# Altium project CPCIs_EEM_Controller.PrjPCB (part 1 of 2)
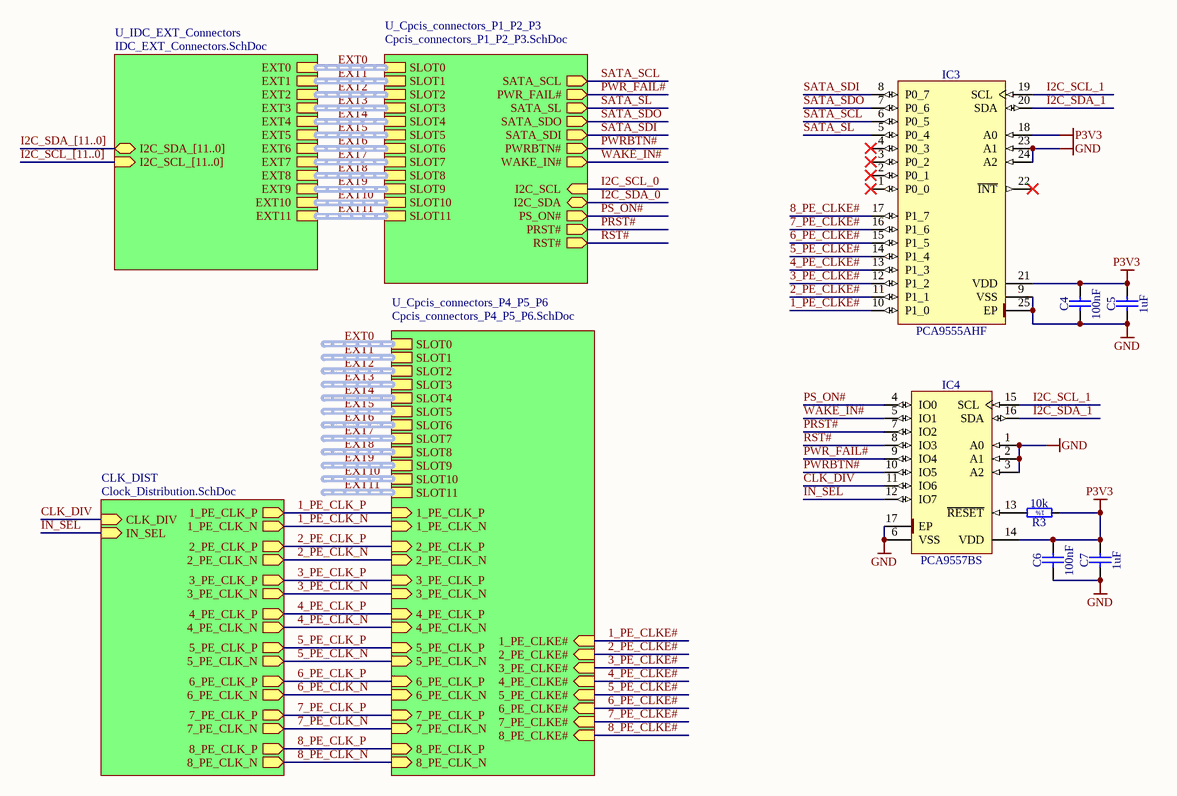
[diagram p0: CPCIS_EEM_Controller.SchDoc]
5 sheets, 84 parts. Net scope: hierarchical (ports join the sheet entries above them; power ports are global).
Board file: cPCIs_controller.pcbdoc
Sheets:
  CPCIS_EEM_Controller.SchDoc
    U_Cpcis_connectors_P1_P2_P3 = Cpcis_connectors_P1_P2_P3.SchDoc
    U_Cpcis_connectors_P4_P5_P6 = Cpcis_connectors_P4_P5_P6.SchDoc
    U_IDC_EXT_Connectors = IDC_EXT_Connectors.SchDoc
    CLK_DIST = Clock_Distribution.SchDoc

## Sheet CPCIS_EEM_Controller.SchDoc
size A4

### Parts
C4  100nF  [CAPC0603X33N]
C5  1uF  [CAPC1608X87N]
C6  100nF  [CAPC0603X33N]
C7  1uF  [CAPC1608X87N]
IC3  PCA9555AHF  [QFN50P400X400X80-25N-S225]
IC4  PCA9557BS  [QFN65P400X400X100-17N-S225]
R3  10k  [RESC1005X40N]

### Sub-sheets
CLK_DIST = Clock_Distribution.SchDoc: 1_PE_CLK_P (out), 1_PE_CLK_N (out), 2_PE_CLK_P (out), 2_PE_CLK_N (out), 3_PE_CLK_P (out), 3_PE_CLK_N (out), 4_PE_CLK_P (out), 4_PE_CLK_N (out), 5_PE_CLK_P (out), 5_PE_CLK_N (out), 6_PE_CLK_P (out), 6_PE_CLK_N (out), 7_PE_CLK_P (out), 7_PE_CLK_N (out), 8_PE_CLK_P (out), 8_PE_CLK_N (out), CLK_DIV (in), IN_SEL (in)
U_Cpcis_connectors_P1_P2_P3 = Cpcis_connectors_P1_P2_P3.SchDoc: SLOT2 (harness ExtensionConnector), SLOT3 (harness ExtensionConnector), SLOT1 (harness ExtensionConnector), SLOT4 (harness ExtensionConnector), SLOT5 (harness ExtensionConnector), SLOT6 (harness ExtensionConnector), SLOT7 (harness ExtensionConnector), SLOT8 (harness ExtensionConnector), SATA_SCL (out), PWR_FAIL# (out), SATA_SL (out), SATA_SDO (out), SATA_SDI (out), PWRBTN# (out), WAKE_IN# (out), I2C_SCL (in), I2C_SDA (bidir), PS_ON# (out), PRST# (out), RST# (out), SLOT9 (harness ExtensionConnector), SLOT10 (harness ExtensionConnector), SLOT11 (harness ExtensionConnector), SLOT0 (harness ExtensionConnector)
U_Cpcis_connectors_P4_P5_P6 = Cpcis_connectors_P4_P5_P6.SchDoc: SLOT2 (harness ExtensionConnector), SLOT3 (harness ExtensionConnector), SLOT1 (harness ExtensionConnector), SLOT4 (harness ExtensionConnector), SLOT5 (harness ExtensionConnector), SLOT6 (harness ExtensionConnector), SLOT7 (harness ExtensionConnector), SLOT8 (harness ExtensionConnector), 1_PE_CLK_P (in), 1_PE_CLK_N (in), 2_PE_CLK_P (in), 2_PE_CLK_N (in), 3_PE_CLK_P (in), 3_PE_CLK_N (in), 4_PE_CLK_P (in), 4_PE_CLK_N (in), 5_PE_CLK_P (in), 5_PE_CLK_N (in), 6_PE_CLK_P (in), 6_PE_CLK_N (in), 7_PE_CLK_P (in), 7_PE_CLK_N (in), 8_PE_CLK_P (in), 8_PE_CLK_N (in), 3_PE_CLKE# (in), 6_PE_CLKE# (in), 1_PE_CLKE# (in), 5_PE_CLKE# (in), 7_PE_CLKE# (in), 4_PE_CLKE# (in), 8_PE_CLKE# (in), 2_PE_CLKE# (in), SLOT9 (harness ExtensionConnector), SLOT10 (harness ExtensionConnector), SLOT11 (harness ExtensionConnector), SLOT0 (harness ExtensionConnector)
U_IDC_EXT_Connectors = IDC_EXT_Connectors.SchDoc: EXT0 (harness ExtensionConnector), EXT2 (harness ExtensionConnector), EXT4 (harness ExtensionConnector), EXT5 (harness ExtensionConnector), EXT6 (harness ExtensionConnector), EXT7 (harness ExtensionConnector), I2C_SDA_[11..0] (bidir), I2C_SCL_[11..0] (in), EXT3 (harness ExtensionConnector), EXT1 (harness ExtensionConnector), EXT8 (harness ExtensionConnector), EXT9 (harness ExtensionConnector), EXT10 (harness ExtensionConnector), EXT11 (harness ExtensionConnector)

### Nets
GND: C4.1 C5.1 C6.1 C7.1 IC3.9(VSS) IC3.23(A1) IC3.24(A2) IC3.25(EP) IC4.1(A0) IC4.2(A1) IC4.3(A2) IC4.6(VSS) IC4.17(EP)
P3V3: C4.2 C5.2 C6.2 C7.2 IC3.18(A0) IC3.21(VDD) IC4.14(VDD) R3.1
1_PE_CLK_N: sheet U_Cpcis_connectors_P4_P5_P6/1_PE_CLK_N, sheet CLK_DIST/1_PE_CLK_N
1_PE_CLK_P: sheet U_Cpcis_connectors_P4_P5_P6/1_PE_CLK_P, sheet CLK_DIST/1_PE_CLK_P
1_PE_CLKE#: IC3.10(P1_0) ; sheet U_Cpcis_connectors_P4_P5_P6/1_PE_CLKE#
2_PE_CLK_N: sheet U_Cpcis_connectors_P4_P5_P6/2_PE_CLK_N, sheet CLK_DIST/2_PE_CLK_N
2_PE_CLK_P: sheet U_Cpcis_connectors_P4_P5_P6/2_PE_CLK_P, sheet CLK_DIST/2_PE_CLK_P
2_PE_CLKE#: IC3.11(P1_1) ; sheet U_Cpcis_connectors_P4_P5_P6/2_PE_CLKE#
3_PE_CLK_N: sheet U_Cpcis_connectors_P4_P5_P6/3_PE_CLK_N, sheet CLK_DIST/3_PE_CLK_N
3_PE_CLK_P: sheet U_Cpcis_connectors_P4_P5_P6/3_PE_CLK_P, sheet CLK_DIST/3_PE_CLK_P
3_PE_CLKE#: IC3.12(P1_2) ; sheet U_Cpcis_connectors_P4_P5_P6/3_PE_CLKE#
4_PE_CLK_N: sheet U_Cpcis_connectors_P4_P5_P6/4_PE_CLK_N, sheet CLK_DIST/4_PE_CLK_N
4_PE_CLK_P: sheet U_Cpcis_connectors_P4_P5_P6/4_PE_CLK_P, sheet CLK_DIST/4_PE_CLK_P
4_PE_CLKE#: IC3.13(P1_3) ; sheet U_Cpcis_connectors_P4_P5_P6/4_PE_CLKE#
5_PE_CLK_N: sheet U_Cpcis_connectors_P4_P5_P6/5_PE_CLK_N, sheet CLK_DIST/5_PE_CLK_N
5_PE_CLK_P: sheet U_Cpcis_connectors_P4_P5_P6/5_PE_CLK_P, sheet CLK_DIST/5_PE_CLK_P
5_PE_CLKE#: IC3.14(P1_4) ; sheet U_Cpcis_connectors_P4_P5_P6/5_PE_CLKE#
6_PE_CLK_N: sheet U_Cpcis_connectors_P4_P5_P6/6_PE_CLK_N, sheet CLK_DIST/6_PE_CLK_N
6_PE_CLK_P: sheet U_Cpcis_connectors_P4_P5_P6/6_PE_CLK_P, sheet CLK_DIST/6_PE_CLK_P
6_PE_CLKE#: IC3.15(P1_5) ; sheet U_Cpcis_connectors_P4_P5_P6/6_PE_CLKE#
7_PE_CLK_N: sheet U_Cpcis_connectors_P4_P5_P6/7_PE_CLK_N, sheet CLK_DIST/7_PE_CLK_N
7_PE_CLK_P: sheet U_Cpcis_connectors_P4_P5_P6/7_PE_CLK_P, sheet CLK_DIST/7_PE_CLK_P
7_PE_CLKE#: IC3.16(P1_6) ; sheet U_Cpcis_connectors_P4_P5_P6/7_PE_CLKE#
8_PE_CLK_N: sheet U_Cpcis_connectors_P4_P5_P6/8_PE_CLK_N, sheet CLK_DIST/8_PE_CLK_N
8_PE_CLK_P: sheet U_Cpcis_connectors_P4_P5_P6/8_PE_CLK_P, sheet CLK_DIST/8_PE_CLK_P
8_PE_CLKE#: IC3.17(P1_7) ; sheet U_Cpcis_connectors_P4_P5_P6/8_PE_CLKE#
CLK_DIV: IC4.11(IO6) ; sheet CLK_DIST/CLK_DIV
I2C_SCL_1: IC3.19(SCL) IC4.15(SCL)
I2C_SDA_1: IC3.20(SDA) IC4.16(SDA)
IN_SEL: IC4.12(IO7) ; sheet CLK_DIST/IN_SEL
PRST#: IC4.7(IO2) ; sheet U_Cpcis_connectors_P1_P2_P3/PRST#
PS_ON#: IC4.4(IO0) ; sheet U_Cpcis_connectors_P1_P2_P3/PS_ON#
PWR_FAIL#: IC4.9(IO4) ; sheet U_Cpcis_connectors_P1_P2_P3/PWR_FAIL#
PWRBTN#: IC4.10(IO5) ; sheet U_Cpcis_connectors_P1_P2_P3/PWRBTN#
RST#: IC4.8(IO3) ; sheet U_Cpcis_connectors_P1_P2_P3/RST#
SATA_SCL: IC3.6(P0_5) ; sheet U_Cpcis_connectors_P1_P2_P3/SATA_SCL
SATA_SDI: IC3.8(P0_7) ; sheet U_Cpcis_connectors_P1_P2_P3/SATA_SDI
SATA_SDO: IC3.7(P0_6) ; sheet U_Cpcis_connectors_P1_P2_P3/SATA_SDO
SATA_SL: IC3.5(P0_4) ; sheet U_Cpcis_connectors_P1_P2_P3/SATA_SL
WAKE_IN#: IC4.5(IO1) ; sheet U_Cpcis_connectors_P1_P2_P3/WAKE_IN#
NetIC4_13: IC4.13(~{RESET}) R3.2

Not connected (* = marked no-connect by the designer): IC3 1(P0_0)* 2(P0_1)* 3(P0_2)* 4(P0_3)* 22(~{INT})*

### Buses and harness runs
bus I2C_SCL_[11..0] = sheet U_IDC_EXT_Connectors/I2C_SCL_[11..0]
bus I2C_SDA_[11..0] = sheet U_IDC_EXT_Connectors/I2C_SDA_[11..0]
harness EXT0 = sheet U_Cpcis_connectors_P1_P2_P3/SLOT0 = sheet U_IDC_EXT_Connectors/EXT0
harness EXT0 = sheet U_Cpcis_connectors_P4_P5_P6/SLOT0
harness EXT1 = sheet U_Cpcis_connectors_P1_P2_P3/SLOT1 = sheet U_IDC_EXT_Connectors/EXT1
harness EXT1 = sheet U_Cpcis_connectors_P4_P5_P6/SLOT1
harness EXT2 = sheet U_Cpcis_connectors_P1_P2_P3/SLOT2 = sheet U_IDC_EXT_Connectors/EXT2
harness EXT2 = sheet U_Cpcis_connectors_P4_P5_P6/SLOT2
harness EXT3 = sheet U_Cpcis_connectors_P1_P2_P3/SLOT3 = sheet U_IDC_EXT_Connectors/EXT3
harness EXT3 = sheet U_Cpcis_connectors_P4_P5_P6/SLOT3
harness EXT4 = sheet U_Cpcis_connectors_P1_P2_P3/SLOT4 = sheet U_IDC_EXT_Connectors/EXT4
harness EXT4 = sheet U_Cpcis_connectors_P4_P5_P6/SLOT4
harness EXT5 = sheet U_Cpcis_connectors_P1_P2_P3/SLOT5 = sheet U_IDC_EXT_Connectors/EXT5
harness EXT5 = sheet U_Cpcis_connectors_P4_P5_P6/SLOT5
harness EXT6 = sheet U_Cpcis_connectors_P1_P2_P3/SLOT6 = sheet U_IDC_EXT_Connectors/EXT6
harness EXT6 = sheet U_Cpcis_connectors_P4_P5_P6/SLOT6
harness EXT7 = sheet U_Cpcis_connectors_P1_P2_P3/SLOT7 = sheet U_IDC_EXT_Connectors/EXT7
harness EXT7 = sheet U_Cpcis_connectors_P4_P5_P6/SLOT7
harness EXT8 = sheet U_Cpcis_connectors_P1_P2_P3/SLOT8 = sheet U_IDC_EXT_Connectors/EXT8
harness EXT8 = sheet U_Cpcis_connectors_P4_P5_P6/SLOT8
harness EXT9 = sheet U_Cpcis_connectors_P1_P2_P3/SLOT9 = sheet U_IDC_EXT_Connectors/EXT9
harness EXT9 = sheet U_Cpcis_connectors_P4_P5_P6/SLOT9
harness EXT10 = sheet U_Cpcis_connectors_P1_P2_P3/SLOT10 = sheet U_IDC_EXT_Connectors/EXT10
harness EXT10 = sheet U_Cpcis_connectors_P4_P5_P6/SLOT10
harness EXT11 = sheet U_Cpcis_connectors_P1_P2_P3/SLOT11 = sheet U_IDC_EXT_Connectors/EXT11
harness EXT11 = sheet U_Cpcis_connectors_P4_P5_P6/SLOT11

### Notes on the sheet
- (in symbol R0402_10K_1%_0.0625W_100PPM) 1%

### Library data of the parts
C4 C6 = CC0201_100NF_6.3V_10%_X5R: Non-polarised capacitor; Part Description: SMD Multilayer Chip Ceramic Capacitor; Manufacturer: GENERIC; Manufacturer1 Part Number: 02016D104KAT2A; Voltage: 6.3V; TC: X5R; Tolerance: ±10%; Part Number: CC0201_100NF_6.3V_10%_X5R; Component Kind: Standard; Component Type: Standard; Pin Count: 2; Value: 100nF; Status: Not Recommended; Manufacturer Part Number: CC0201_100NF_6.3V_10%_X5R; Case: 0201; Mounted: Yes; Socket: No; SMD: Yes; Sense: No; Manufacturer1 Example: AVX; Manufacturer1 ComponentHeight: 0.33mm; HelpURL: \\cern.ch\dfs\Applications\Altium\Datasheets\CC0201_X5R_AVX.pdf; Author: CERN DEM JLC; CreateDate: 03.12.2007; LatestRevisionDate: 03.12.2007
C5 C7 = CC0603_1UF_25V_10%_X7R: Non-polarised capacitor; Part Description: SMD Multilayer Chip Ceramic Capacitor; Manufacturer: GENERIC; Manufacturer1 Part Number: GRM188R71E105KA12D; Voltage: 25V; TC: X7R; Tolerance: ±10%; Part Number: CC0603_1UF_25V_10%_X7R; Component Kind: Standard; Component Type: Standard; Pin Count: 2; Value: 1uF; Status: None; Manufacturer Part Number: CC0603_1UF_25V_10%_X7R; Case: 0603; Mounted: Yes; Socket: No; SMD: Yes; Sense: No; Manufacturer1 Example: MURATA; Manufacturer1 ComponentHeight: 0.9mm; HelpURL: \\cern.ch\dfs\Applications\Altium\Datasheets\CC0603_X7R_MURATA.pdf; Author: CERN DEM JLC; CreateDate: 18.01.2011; LatestRevisionDate: 18.01.2011
IC3 = PCA9555AHF: Low-Voltage 16-Bit I2C-bus I/O Port With Interrupt and Weak Pull-Up; Manufacturer: NXP SEMICONDUCTORS; PressFit: No; Bonding: No; Part Number: PCA9555AHF; Component Kind: Standard; Component Type: Standard; Device: PCA9555AHF; PackageDescription: QFN, 0.50mm Pitch, Square; 24 Pin, 4.00mm L X 4.00mm W X 0.80mm H body (w/Thermal Tab 2.25 X 2.25mm), IPC Medium Density; Part Description: Low-Voltage 16-Bit I2C-bus I/O Port With Interrupt and Weak Pull-Up; Manufacturer Part Number: PCA9555AHF; Pin Count: 25; Case: QFN24; Mounted: Yes; Socket: No; SMD: Yes; Sense: No; ComponentHeight: 0.8mm; Author: CERN DEM BC; HelpURL: \\cern.ch\dfs\Applications\Altium\Datasheets\PCA9555AHF.pdf; CreateDate: 24.07.2015; LatestRevisionDate: 24.07.2015
IC4 = PCA9557BS: 8-Bit I2C-bus and SMBus I/O Port with Reset; Manufacturer: NXP SEMICONDUCTORS; PressFit: No; Bonding: No; Part Number: PCA9557BS; Component Kind: Standard; Component Type: Standard; Device: PCA9557BS; PackageDescription: QFN, 0.65mm Pitch, Square; 16 Pin, 4.00mm L X 4.00mm W X 1.00mm H body (w/Thermal Tab 2.25 X 2.25mm), IPC Medium Density; Part Description: 8-Bit I2C-bus and SMBus I/O Port with Reset; Manufacturer Part Number: PCA9557BS; Pin Count: 17; Case: QFN16; Mounted: Yes; Socket: No; SMD: Yes; Sense: No; ComponentHeight: 1mm; Author: CERN DEM JMW; HelpURL: \\cern.ch\dfs\Applications\Altium\Datasheets\PCA9557BS.pdf; CreateDate: 22.09.2015; LatestRevisionDate: 22.09.2015
R3 = R0402_10K_1%_0.0625W_100PPM: Resistor - 1%; Part Description: General Purpose Thick Film Chip Resistor; Manufacturer: GENERIC; Manufacturer1 Part Number: 232270671003L; TC: ±100ppm/°C; Part Number: R0402_10K_1%_0.0625W_100PPM; Component Kind: Standard; Component Type: Standard; Pin Count: 2; Value: 10k; Status: Not recommended; Power: 0.0625W; Tolerance: ±1%; Manufacturer Part Number: R0402_10K_1%_0.0625W_100PPM; Case: 0402; Mounted: Yes; Sense: No; Socket: No; SMD: Yes; Manufacturer1 Example: YAGEO PHYCOMP; Manufacturer1 ComponentHeight: 0.4mm; HelpURL: \\cern.ch\dfs\Applications\Altium\Datasheets\R0402_Phycomp_RC0402.pdf; Author: CERN DEM JLC; CreateDate: 03.12.2007; LatestRevisionDate: 17.10.2012

## Sheet Cpcis_connectors_P1_P2_P3.SchDoc: CPCIS Backplane
size 420 x 297 mm; CheckedBy: A.Paixao; CompanyName: CERN; DrawnBy: G. Daniluk; Engineer: G. Daniluk; Organization: CERN; Address1: European Organization for Nuclear Research; Address2: CH-1211 Genève 23 - Switzerland; DocumentNumber: 18; SheetNumber: 18; SheetTotal: 19; Title2: P1 to P4; DivGrp: BE/CO; Designer: G. Daniluk; EDA_Number: EDA-03828-V1-0; Projet: DIOT Demonstrator System Board (based on C-GEFE v1); ModifiedBy: G. Daniluk; CheckedDate: 18/06/2018; ProjectName: Distributed I/O Tier
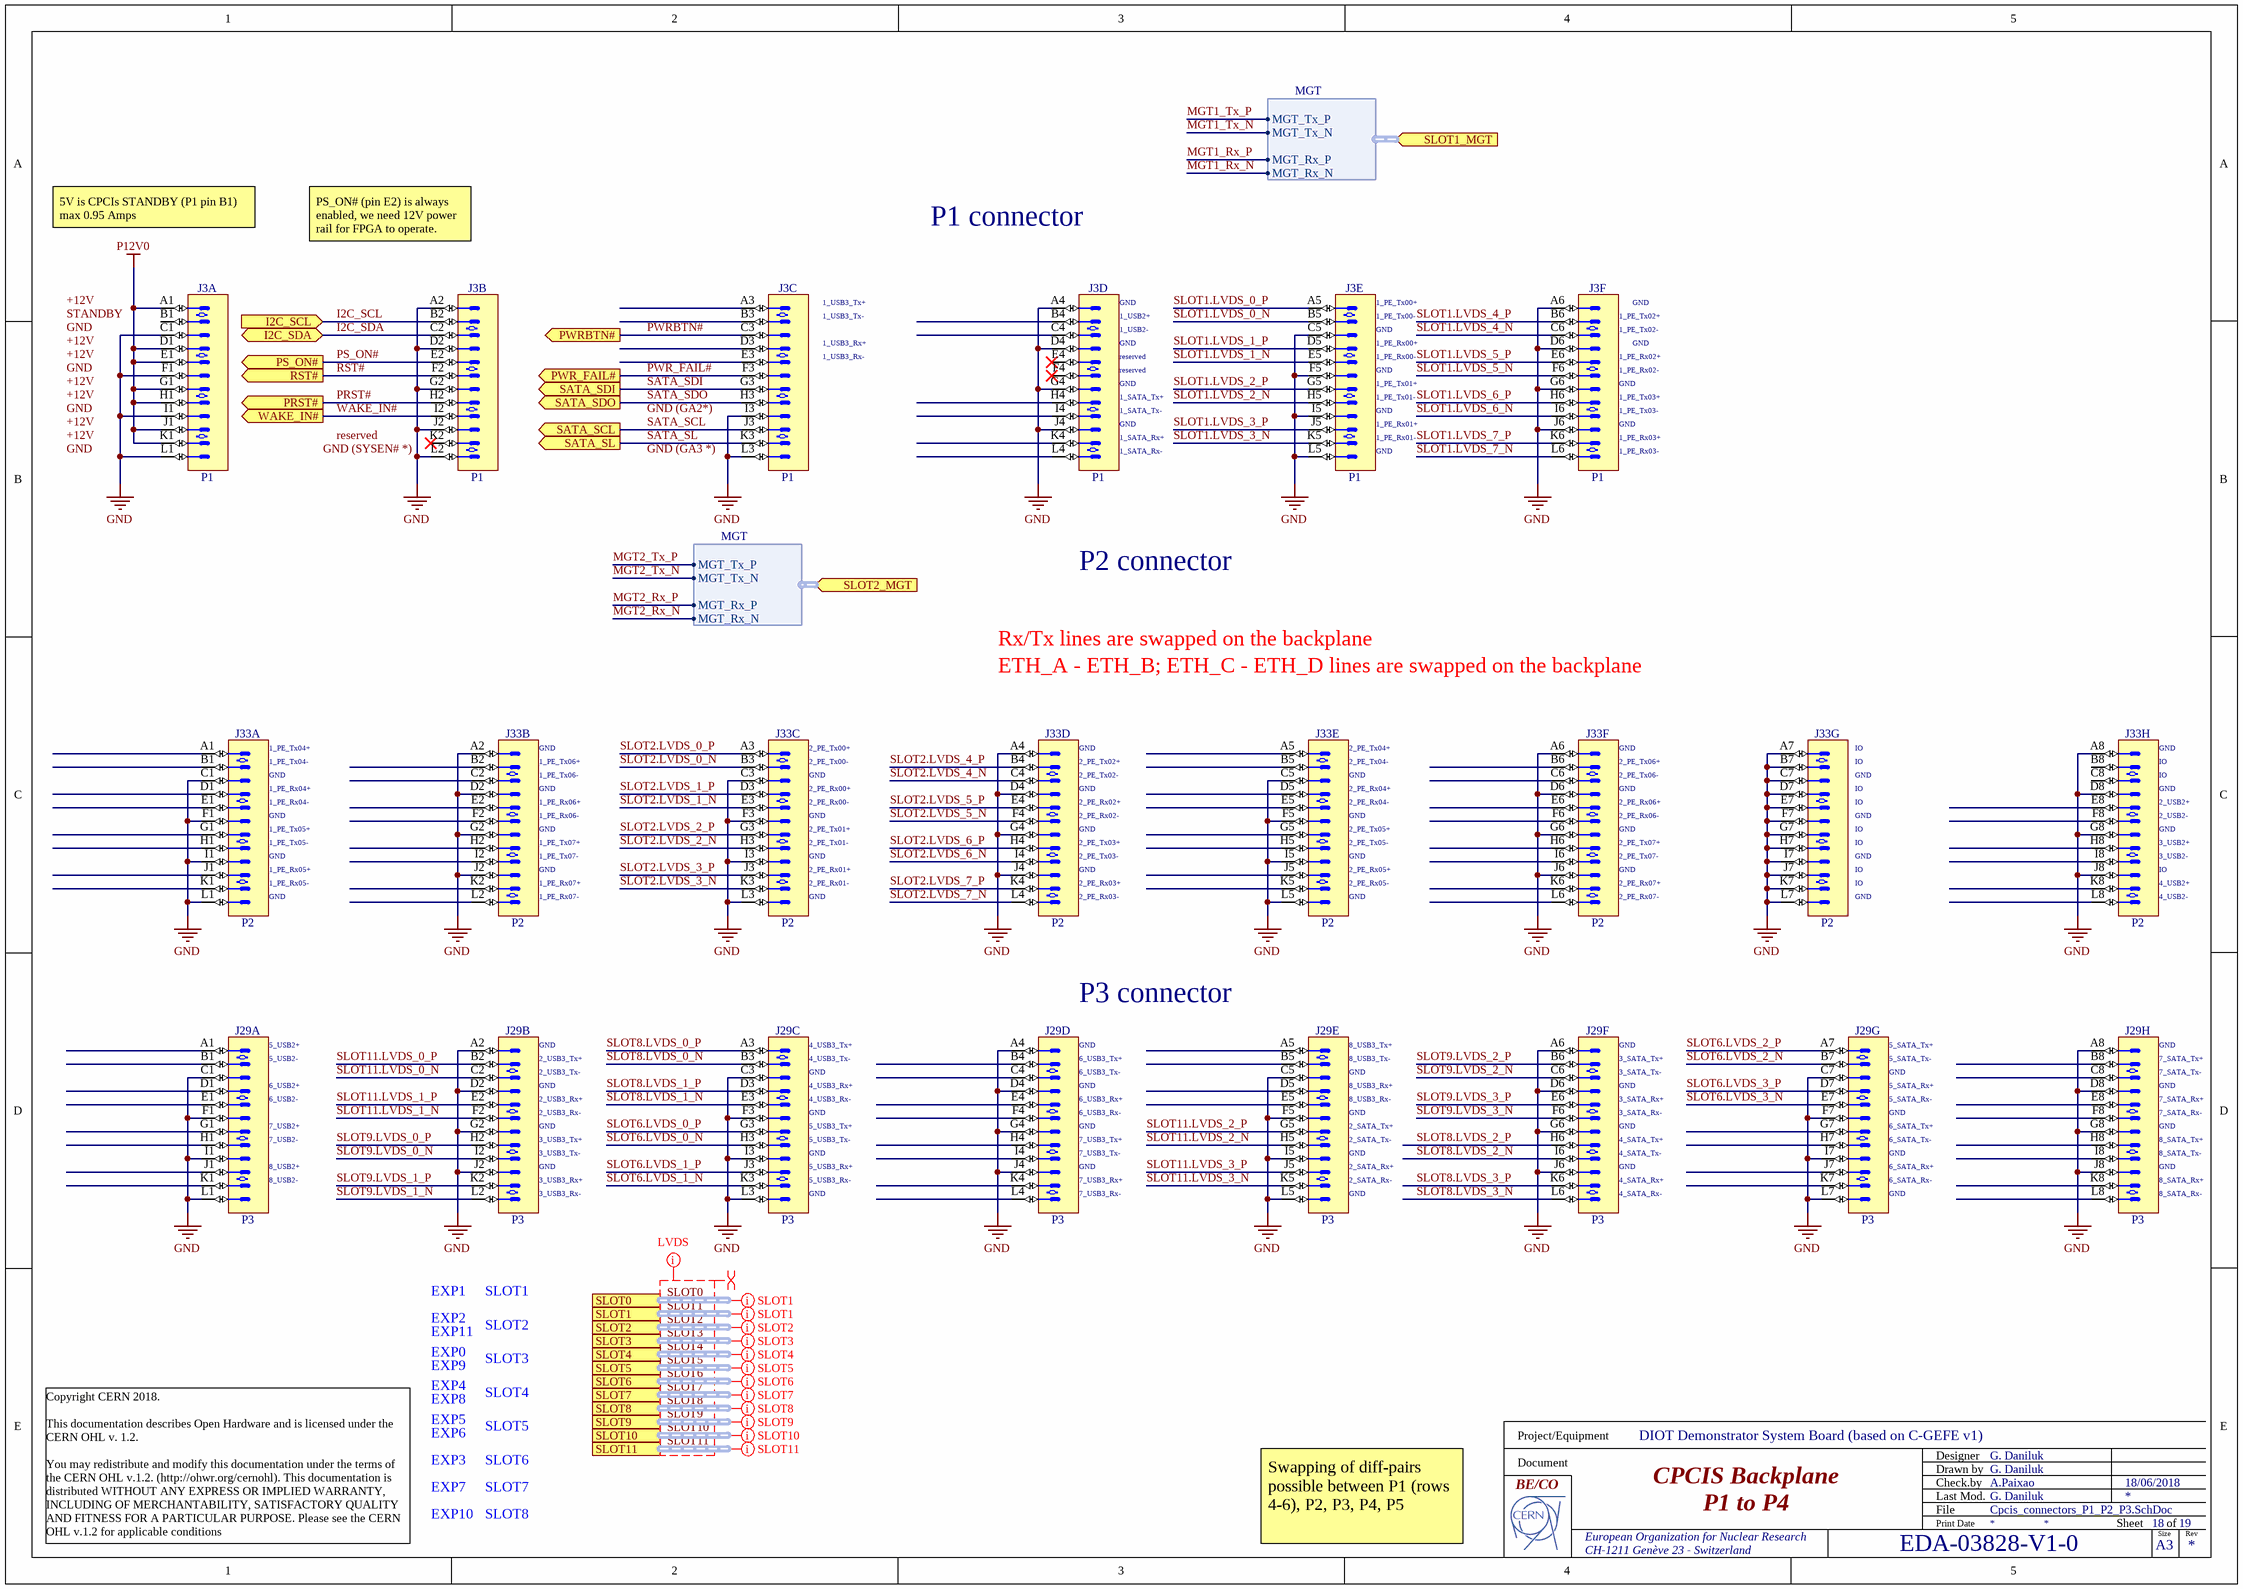
[diagram p1: Cpcis_connectors_P1_P2_P3.SchDoc]

### Parts
J3  P1  [AMPHENOL_10052825-101LF]  (parts A,B,C,D,E,F of 6)
J29  P3  [AMPHENOL_10052837-101LF]  (parts A,B,C,D,E,F,G,H of 8)
J33  P2  [AMPHENOL_10052837-101LF]  (parts A,B,C,D,E,F,G,H of 8)

### Ports
I2C_SCL (in), I2C_SDA (bidir), PRST# (out), PS_ON# (out), PWR_FAIL# (out), PWRBTN# (out), RST# (out), SATA_SCL (out), SATA_SDI (out), SATA_SDO (out), SATA_SL (out), SLOT0 (harness ExtensionConnector), SLOT1 (harness ExtensionConnector), SLOT1_MGT (in, harness MGT), SLOT2 (harness ExtensionConnector), SLOT2_MGT (in, harness MGT), SLOT3 (harness ExtensionConnector), SLOT4 (harness ExtensionConnector), SLOT5 (harness ExtensionConnector), SLOT6 (harness ExtensionConnector), SLOT7 (harness ExtensionConnector), SLOT8 (harness ExtensionConnector), SLOT9 (harness ExtensionConnector), SLOT10 (harness ExtensionConnector), SLOT11 (harness ExtensionConnector), WAKE_IN# (out)

### Harnesses
MGT: MGT_Tx_P, MGT_Tx_N, MGT_Rx_P, MGT_Rx_N

### Nets
GND: J3.A2 J3.A4 J3.A6 J3.C1 J3.C5 J3.D2 J3.D4 J3.D6 J3.F1 J3.F5 J3.G2 J3.G4 J3.G6 J3.I1 J3.I3 J3.I5 J3.J2 J3.J4 J3.J6 J3.L1 J3.L2 J3.L3 J3.L5 J29.A2 J29.A4 J29.A6 J29.A8 J29.C1 J29.C3 J29.C5 J29.C7 J29.D2 J29.D4 J29.D6 J29.D8 J29.F1 J29.F3 J29.F5 J29.F7 J29.G2 J29.G4 J29.G6 J29.G8 J29.I1 J29.I3 J29.I5 J29.I7 J29.J2 J29.J4 J29.J6 J29.J8 J29.L1 J29.L3 J29.L5 J29.L7 J33.A2 J33.A4 J33.A6 J33.A7 J33.A8 J33.B7 J33.C1 J33.C3 J33.C5 J33.C7 J33.D2 J33.D4 J33.D6 J33.D7 J33.D8 J33.E7 J33.F1 J33.F3 J33.F5 J33.F7 J33.G2 J33.G4 J33.G6 J33.G7 J33.G8 J33.H7 J33.I1 J33.I3 J33.I5 J33.I7 J33.J2 J33.J4 J33.J6 J33.J7 J33.J8 J33.K7 J33.L1 J33.L3 J33.L5 J33.L7
P12V0: J3.A1 J3.D1 J3.E1 J3.G1 J3.H1 J3.J1 J3.K1
I2C_SCL: J3.B2 ; port I2C_SCL
I2C_SDA: J3.C2 ; port I2C_SDA
MGT1_Rx_N: port SLOT1_MGT.MGT_Rx_N
MGT1_Rx_P: port SLOT1_MGT.MGT_Rx_P
MGT1_Tx_N: port SLOT1_MGT.MGT_Tx_N
MGT1_Tx_P: port SLOT1_MGT.MGT_Tx_P
MGT2_Rx_N: port SLOT2_MGT.MGT_Rx_N
MGT2_Rx_P: port SLOT2_MGT.MGT_Rx_P
MGT2_Tx_N: port SLOT2_MGT.MGT_Tx_N
MGT2_Tx_P: port SLOT2_MGT.MGT_Tx_P
PRST#: J3.H2 ; port PRST#
PS_ON#: J3.E2 ; port PS_ON#
PWR_FAIL#: J3.F3 ; port PWR_FAIL#
PWRBTN#: J3.C3 ; port PWRBTN#
RST#: J3.F2 ; port RST#
SATA_SCL: J3.J3 ; port SATA_SCL
SATA_SDI: J3.G3 ; port SATA_SDI
SATA_SDO: J3.H3 ; port SATA_SDO
SATA_SL: J3.K3 ; port SATA_SL
SLOT1.LVDS_0_N: J3.B5
SLOT1.LVDS_0_P: J3.A5
SLOT1.LVDS_1_N: J3.E5
SLOT1.LVDS_1_P: J3.D5
SLOT1.LVDS_2_N: J3.H5
SLOT1.LVDS_2_P: J3.G5
SLOT1.LVDS_3_N: J3.K5
SLOT1.LVDS_3_P: J3.J5
SLOT1.LVDS_4_N: J3.C6
SLOT1.LVDS_4_P: J3.B6
SLOT1.LVDS_5_N: J3.F6
SLOT1.LVDS_5_P: J3.E6
SLOT1.LVDS_6_N: J3.I6
SLOT1.LVDS_6_P: J3.H6
SLOT1.LVDS_7_N: J3.L6
SLOT1.LVDS_7_P: J3.K6
SLOT2.LVDS_0_N: J33.B3
SLOT2.LVDS_0_P: J33.A3
SLOT2.LVDS_1_N: J33.E3
SLOT2.LVDS_1_P: J33.D3
SLOT2.LVDS_2_N: J33.H3
SLOT2.LVDS_2_P: J33.G3
SLOT2.LVDS_3_N: J33.K3
SLOT2.LVDS_3_P: J33.J3
SLOT2.LVDS_4_N: J33.C4
SLOT2.LVDS_4_P: J33.B4
SLOT2.LVDS_5_N: J33.F4
SLOT2.LVDS_5_P: J33.E4
SLOT2.LVDS_6_N: J33.I4
SLOT2.LVDS_6_P: J33.H4
SLOT2.LVDS_7_N: J33.L4
SLOT2.LVDS_7_P: J33.K4
SLOT6.LVDS_0_N: J29.H3
SLOT6.LVDS_0_P: J29.G3
SLOT6.LVDS_1_N: J29.K3
SLOT6.LVDS_1_P: J29.J3
SLOT6.LVDS_2_N: J29.B7
SLOT6.LVDS_2_P: J29.A7
SLOT6.LVDS_3_N: J29.E7
SLOT6.LVDS_3_P: J29.D7
SLOT8.LVDS_0_N: J29.B3
SLOT8.LVDS_0_P: J29.A3
SLOT8.LVDS_1_N: J29.E3
SLOT8.LVDS_1_P: J29.D3
SLOT8.LVDS_2_N: J29.I6
SLOT8.LVDS_2_P: J29.H6
SLOT8.LVDS_3_N: J29.L6
SLOT8.LVDS_3_P: J29.K6
SLOT9.LVDS_0_N: J29.I2
SLOT9.LVDS_0_P: J29.H2
SLOT9.LVDS_1_N: J29.L2
SLOT9.LVDS_1_P: J29.K2
SLOT9.LVDS_2_N: J29.C6
SLOT9.LVDS_2_P: J29.B6
SLOT9.LVDS_3_N: J29.F6
SLOT9.LVDS_3_P: J29.E6
SLOT11.LVDS_0_N: J29.C2
SLOT11.LVDS_0_P: J29.B2
SLOT11.LVDS_1_N: J29.F2
SLOT11.LVDS_1_P: J29.E2
SLOT11.LVDS_2_N: J29.H5
SLOT11.LVDS_2_P: J29.G5
SLOT11.LVDS_3_N: J29.K5
SLOT11.LVDS_3_P: J29.J5
WAKE_IN#: J3.I2 ; port WAKE_IN#

Not connected (* = marked no-connect by the designer): J3 A3 B1 B3 B4 C4 D3 E3 E4* F4* H4 I4 K2* K4 L4; J29 A1 A5 B1 B4 B5 B8 C4 C8 D1 D5 E1 E4 E5 E8 F4 F8 G1 G7 H1 H4 H7 H8 I4 I8 J1 J7 K1 K4 K7 K8 L4 L8; J33 A1 A5 B1 B2 B5 B6 B8 C2 C6 C8 D1 D5 E1 E2 E5 E6 E8 F2 F6 F8 G1 G5 H1 H2 H5 H6 H8 I2 I6 I8 J1 J5 K1 K2 K5 K6 K8 L2 L6 L8

### Buses and harness runs
harness SLOT0 = port SLOT0
harness SLOT1 = port SLOT1
harness SLOT2 = port SLOT2
harness SLOT3 = port SLOT3
harness SLOT4 = port SLOT4
harness SLOT5 = port SLOT5
harness SLOT6 = port SLOT6
harness SLOT7 = port SLOT7
harness SLOT8 = port SLOT8
harness SLOT9 = port SLOT9
harness SLOT10 = port SLOT10
harness SLOT11 = port SLOT11

### Layout directives
net class LVDS: SLOT0, SLOT1, SLOT2, SLOT3, SLOT4, SLOT5, SLOT6, SLOT7, SLOT8, SLOT9, SLOT10, SLOT11
net class SLOT1: (no net found under the mark)
net class SLOT2: (no net found under the mark)
net class SLOT3: (no net found under the mark)
net class SLOT4: (no net found under the mark)
net class SLOT5: (no net found under the mark)
net class SLOT6: (no net found under the mark)
net class SLOT7: (no net found under the mark)
net class SLOT8: (no net found under the mark)
differential pair: SLOT0, SLOT1, SLOT2, SLOT3, SLOT4, SLOT5, SLOT6, SLOT7, SLOT8, SLOT9, SLOT10, SLOT11
net class SLOT9: (no net found under the mark)
net class SLOT10: (no net found under the mark)
net class SLOT11: (no net found under the mark)
net class SLOT0: (no net found under the mark)

### Notes on the sheet
- 5V is CPCIs STANDBY (P1 pin B1)
  max 0.95 Amps
- PS_ON# (pin E2) is always enabled, we need 12V power rail for FPGA to operate.
- P1 connector
- 1_USB3_Tx+
- 1_USB3_Tx-
- (near J3) 1_USB2+
- (near J3) GND
- (near J3) 1_PE_Tx00+
- (near J3) 1_PE_Tx00-
- (near J3) 1_PE_Tx02+
- GND
- 1_USB3_Rx+
- 1_USB3_Rx-
- (near J3) 1_USB2-
- (near J3) 1_SATA_Tx+
- (near J3) reserved
- (near J3) 1_PE_Tx01+
- (near J3) 1_PE_Tx01-
- (near J3) 1_PE_Rx00+
- (near J3) 1_PE_Rx00-
- (near J3) 1_PE_Tx02-
- (near J3) 1_PE_Rx02+
- (near J3) 1_PE_Rx02-
- (near J3) 1_PE_Tx03+
- (near J3) 1_SATA_Tx-
- (near J3) 1_SATA_Rx+
- (near J3) 1_SATA_Rx-
- (near J3) 1_PE_Rx01+
- (near J3) 1_PE_Rx01-
- (near J3) 1_PE_Tx03-
- (near J3) 1_PE_Rx03+
- (near J3) 1_PE_Rx03-
- P2 connector
- Rx/Tx lines are swapped on the backplane
- ETH_A - ETH_B; ETH_C - ETH_D lines are swapped on the backplane
- (near J33) 1_PE_Tx04+
- (near J33) 1_PE_Tx04-
- (near J33) GND
- (near J33) 1_PE_Rx04+
- (near J33) 1_PE_Rx04-
- (near J33) 1_PE_Tx06+
- (near J33) 1_PE_Tx06-
- (near J33) 1_PE_Rx06+
- (near J33) 2_PE_Tx00+
- (near J33) 2_PE_Tx00-
- (near J33) 2_PE_Rx00+
- (near J33) 2_PE_Rx00-
- (near J33) 2_PE_Tx02+
- (near J33) 2_PE_Tx02-
- (near J33) 2_PE_Rx02+
- (near J33) 2_PE_Tx04+
- (near J33) 2_PE_Tx04-
- (near J33) 2_PE_Rx04+
- (near J33) 2_PE_Rx04-
- (near J33) 2_PE_Tx06+
- (near J33) 2_PE_Tx06-
- (near J33) 2_PE_Rx06+
- (near J33) IO
- (near J33) 2_USB2+
- (near J33) 1_PE_Tx05+
- (near J33) 1_PE_Tx05-
- (near J33) 1_PE_Rx06-
- (near J33) 1_PE_Tx07+
- (near J33) 1_PE_Tx07-
- (near J33) 2_PE_Tx01+
- (near J33) 2_PE_Tx01-
- (near J33) 2_PE_Rx02-
- (near J33) 2_PE_Tx03+
- (near J33) 2_PE_Tx03-
- (near J33) 2_PE_Tx05+
- (near J33) 2_PE_Tx05-
- (near J33) 2_PE_Rx06-
- (near J33) 2_PE_Tx07+
- (near J33) 2_PE_Tx07-
- (near J33) 2_USB2-
- (near J33) 3_USB2+
- (near J33) 3_USB2-
- (near J33) 1_PE_Rx05+
- (near J33) 1_PE_Rx05-
- (near J33) 1_PE_Rx07+
- (near J33) 1_PE_Rx07-
- (near J33) 2_PE_Rx01+
- (near J33) 2_PE_Rx01-
- (near J33) 2_PE_Rx03+
- (near J33) 2_PE_Rx03-
- (near J33) 2_PE_Rx05+
- (near J33) 2_PE_Rx05-
- (near J33) 2_PE_Rx07+
- (near J33) 2_PE_Rx07-
- (near J33) 4_USB2+
- (near J33) 4_USB2-
- (near J29) 5_USB2+
- (near J29) 5_USB2-
- (near J29) GND
- (near J29) 2_USB3_Tx+
- (near J29) 2_USB3_Tx-
- (near J29) 4_USB3_Tx+
- (near J29) 4_USB3_Tx-
- P3 connector
- (near J29) 6_USB3_Tx+
- (near J29) 6_USB3_Tx-
- (near J29) 8_USB3_Tx+
- (near J29) 8_USB3_Tx-
- (near J29) 3_SATA_Tx+
- (near J29) 3_SATA_Tx-
- (near J29) 5_SATA_Tx+
- (near J29) 5_SATA_Tx-
- (near J29) 7_SATA_Tx+
- (near J29) 7_SATA_Tx-
- (near J29) 6_USB2+
- (near J29) 6_USB2-
- (near J29) 7_USB2+
- (near J29) 2_USB3_Rx+
- (near J29) 2_USB3_Rx-
- (near J29) 4_USB3_Rx+
- (near J29) 4_USB3_Rx-
- (near J29) 5_USB3_Tx+
- (near J29) 6_USB3_Rx+
- (near J29) 6_USB3_Rx-
- (near J29) 8_USB3_Rx+
- (near J29) 8_USB3_Rx-
- (near J29) 2_SATA_Tx+
- (near J29) 3_SATA_Rx+
- (near J29) 3_SATA_Rx-
- (near J29) 5_SATA_Rx+
- (near J29) 5_SATA_Rx-
- (near J29) 6_SATA_Tx+
- (near J29) 7_SATA_Rx+
- (near J29) 7_SATA_Rx-
- (near J29) 7_USB2-
- (near J29) 8_USB2+
- (near J29) 8_USB2-
- (near J29) 3_USB3_Tx+
- (near J29) 3_USB3_Tx-
- (near J29) 3_USB3_Rx+
- (near J29) 3_USB3_Rx-
- (near J29) 5_USB3_Tx-
- (near J29) 5_USB3_Rx+
- (near J29) 5_USB3_Rx-
- (near J29) 7_USB3_Tx+
- (near J29) 7_USB3_Tx-
- (near J29) 7_USB3_Rx+
- (near J29) 7_USB3_Rx-
- (near J29) 2_SATA_Tx-
- (near J29) 2_SATA_Rx+
- (near J29) 2_SATA_Rx-
- (near J29) 4_SATA_Tx+
- (near J29) 4_SATA_Tx-
- (near J29) 4_SATA_Rx+
- (near J29) 4_SATA_Rx-
- (near J29) 6_SATA_Tx-
- (near J29) 6_SATA_Rx+
- (near J29) 6_SATA_Rx-
- (near J29) 8_SATA_Tx+
- (near J29) 8_SATA_Tx-
- (near J29) 8_SATA_Rx+
- (near J29) 8_SATA_Rx-
- EXP1
- EXP2
- EXP11
- SLOT1
- SLOT2
- EXP4
- EXP8
- EXP9
- EXP0
- SLOT3
- SLOT4
- EXP3
- EXP5
- EXP6
- SLOT5
- SLOT6
- Copyright CERN 2018.
  This documentation describes Open Hardware and is licensed under the CERN OHL v. 1.2.
  You may redistribute and modify this documentation under the terms of the CERN OHL v.1.2. (http://ohwr.org/cernohl). This documentation is distributed WITHOUT ANY EXPRESS OR IMPLIED WARRANTY, INCLUDING OF MERCHANTABILITY, SATISFACTORY QUALITY AND FITNESS FOR A PARTICULAR PURPOSE. Please see the CERN OHL v.1.2 for applicable conditions
- EXP7
- EXP10
- SLOT7
- SLOT8
- Swapping of diff-pairs possible between P1 (rows 4-6), P2, P3, P4, P5
- Labels drawn without touching a wire or pin: +12V, GND, GND (GA2*), GND (GA3 *), GND (SYSEN# *), reserved, STANDBY
- Project/Equipment
- Document
- Designer
- Drawn by
- Check.by
- File
- Last Mod.
- Print Date
- Sheet
- Size
- A3
- of
- Rev

### Library data of the parts
J3 = AMPHENOL_10052825-101LF: 72 Contacts Header, 6 Columns, 4 Pairs per Column; Part Description: 72 Contacts, 2mm Pitch, 6 Columns, 4 Pairs per Column, 4 Walls, Right Angle Header; Part Number: AMPHENOL_10052825-101LF; Component Kind: Standard; Component Type: Standard; Pin Count: 72; Family: AirMax VS; Mounted: Yes; Socket: No; SMD: No; PressFit: Yes; Sense: No; Status: None; Manufacturer: AMPHENOL; Manufacturer Part Number: 10052825-101LF; ComponentHeight: 15.35mm; HelpURL: \\cern.ch\dfs\Applications\Altium\Datasheets\AMPHENOL_10052825-101LF.pdf; ComponentLink1URL: \\cern.ch\dfs\Applications\Altium\Datasheets\AMPHENOL_10052825-101LF_Application.pdf; ComponentLink1Description: Application; Author: CERN DEM MR; CreateDate: 19/02/2018; LatestRevisionDate: 19/02/2018; Classname: Overlapping
J29 J33 = AMPHENOL_10052837-101LF: 96 Contacts Header, 8 Columns, 4 Pairs per Column; Part Description: 96 Contacts, 2mm Pitch, 8 Columns, 4 Pairs per Column, 2 Walls, Right Angle Header; Part Number: AMPHENOL_10052837-101LF; Component Kind: Standard; Component Type: Standard; Pin Count: 96; Family: AirMax VS; Mounted: Yes; Socket: No; SMD: No; PressFit: Yes; Sense: No; Status: None; Manufacturer: AMPHENOL; Manufacturer Part Number: 10052837-101LF; ComponentHeight: 15.35mm; HelpURL: \\cern.ch\dfs\Applications\Altium\Datasheets\AMPHENOL_10052837-101LF.pdf; ComponentLink1URL: \\cern.ch\dfs\Applications\Altium\Datasheets\AMPHENOL_10052837-101LF_Application.pdf; ComponentLink1Description: Application; Author: CERN DEM MR; CreateDate: 19/02/2018; LatestRevisionDate: 19/02/2018

## Sheet Cpcis_connectors_P4_P5_P6.SchDoc: CPCIS Backplane
size 420 x 297 mm; CheckedBy: A.Paixao; CompanyName: CERN; DrawnBy: G. Daniluk; Engineer: G. Daniluk; Organization: CERN; Address1: European Organization for Nuclear Research; Address2: CH-1211 Genève 23 - Switzerland; DocumentNumber: 19; Revision: -; SheetNumber: 19; SheetTotal: 19; EDA_Number: EDA-03828-V1-0; Projet: DIOT Demonstrator System Board (based on C-GEFE v1); ModifiedBy: G. Daniluk; CheckedDate: 18/06/2018; Title2: P5 to P6; DivGrp: BE/CO; Designer: G. Daniluk; ModifiedDate: -
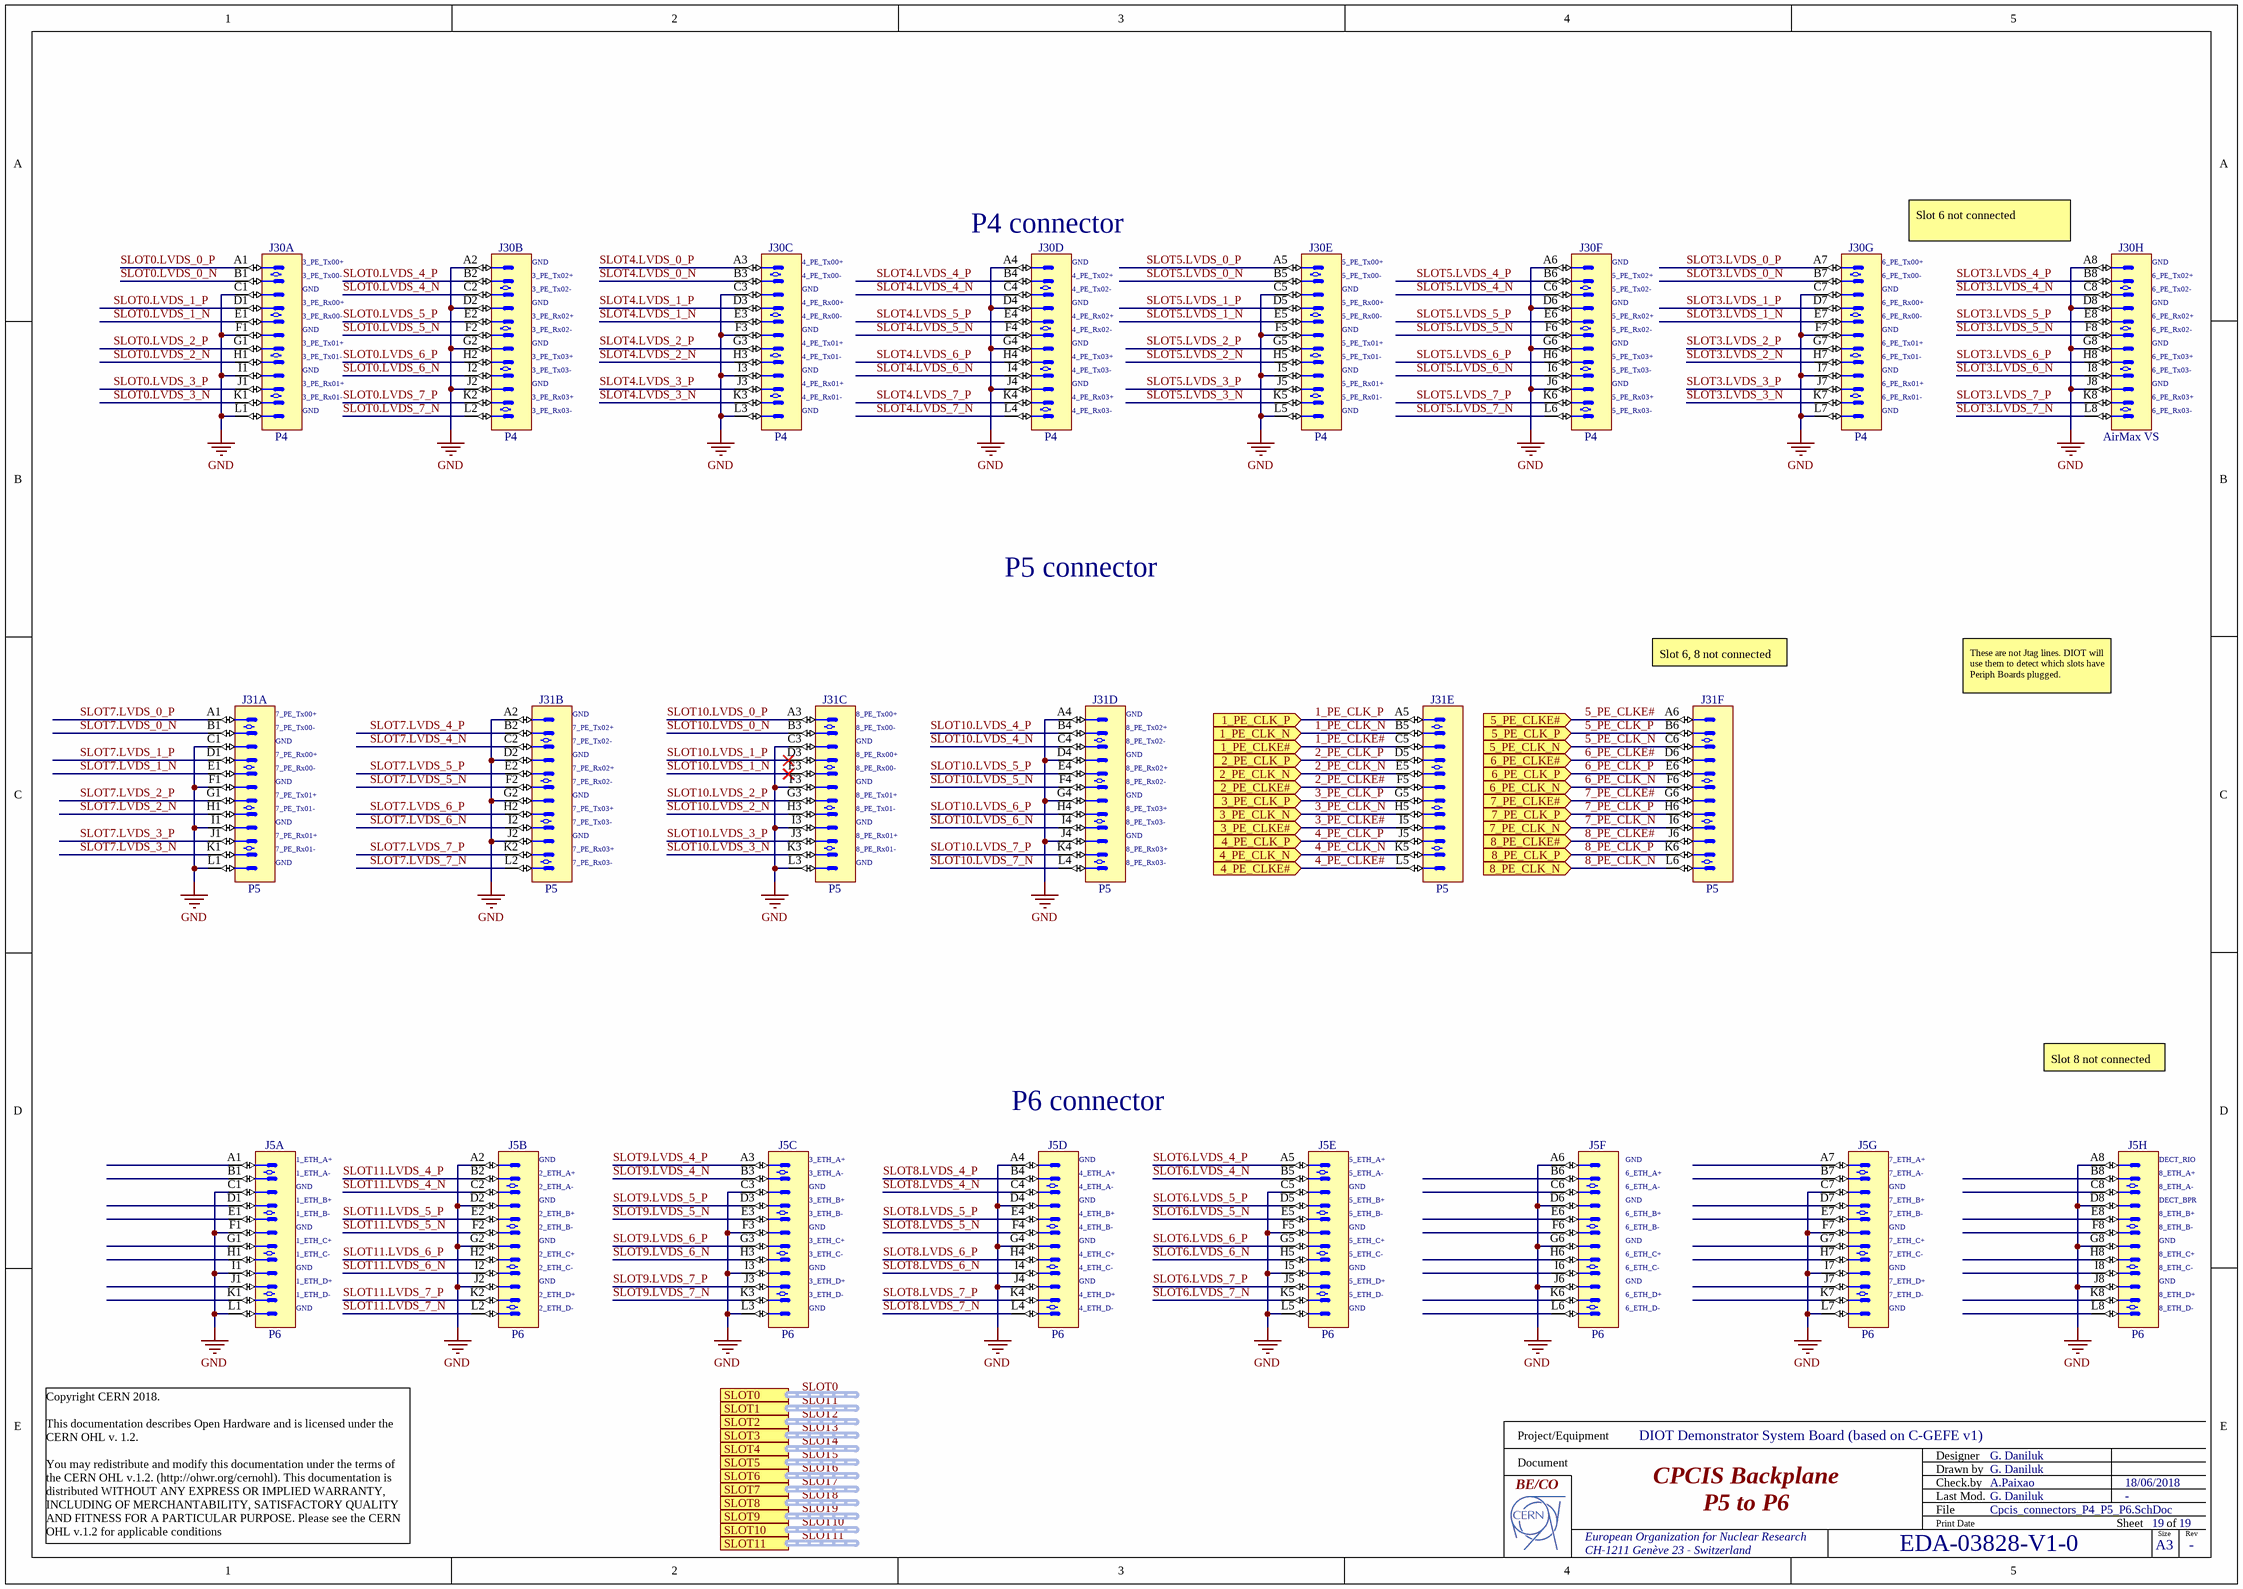
[diagram p2: Cpcis_connectors_P4_P5_P6.SchDoc]

### Parts
J5  P6  [AMPHENOL_10052838-101LF]  (parts A,B,C,D,E,F,G,H of 8)
J30  P4  [AMPHENOL_10052837-101LF]  (parts A,B,C,D,E,F,G,H of 8)
J31  P5  [AMPHENOL_10052824-101LF]  (parts A,B,C,D,E,F of 6)

### Ports
1_PE_CLK_N (in), 1_PE_CLK_P (in), 1_PE_CLKE# (in), 2_PE_CLK_N (in), 2_PE_CLK_P (in), 2_PE_CLKE# (in), 3_PE_CLK_N (in), 3_PE_CLK_P (in), 3_PE_CLKE# (in), 4_PE_CLK_N (in), 4_PE_CLK_P (in), 4_PE_CLKE# (in), 5_PE_CLK_N (in), 5_PE_CLK_P (in), 5_PE_CLKE# (in), 6_PE_CLK_N (in), 6_PE_CLK_P (in), 6_PE_CLKE# (in), 7_PE_CLK_N (in), 7_PE_CLK_P (in), 7_PE_CLKE# (in), 8_PE_CLK_N (in), 8_PE_CLK_P (in), 8_PE_CLKE# (in), SLOT0 (harness ExtensionConnector), SLOT1 (harness ExtensionConnector), SLOT2 (harness ExtensionConnector), SLOT3 (harness ExtensionConnector), SLOT4 (harness ExtensionConnector), SLOT5 (harness ExtensionConnector), SLOT6 (harness ExtensionConnector), SLOT7 (harness ExtensionConnector), SLOT8 (harness ExtensionConnector), SLOT9 (harness ExtensionConnector), SLOT10 (harness ExtensionConnector), SLOT11 (harness ExtensionConnector)

### Nets
GND: J5.A2 J5.A4 J5.A6 J5.A8 J5.C1 J5.C3 J5.C5 J5.C7 J5.D2 J5.D4 J5.D6 J5.D8 J5.F1 J5.F3 J5.F5 J5.F7 J5.G2 J5.G4 J5.G6 J5.G8 J5.I1 J5.I3 J5.I5 J5.I7 J5.J2 J5.J4 J5.J6 J5.J8 J5.L1 J5.L3 J5.L5 J5.L7 J30.A2 J30.A4 J30.A6 J30.A8 J30.C1 J30.C3 J30.C5 J30.C7 J30.D2 J30.D4 J30.D6 J30.D8 J30.F1 J30.F3 J30.F5 J30.F7 J30.G2 J30.G4 J30.G6 J30.G8 J30.I1 J30.I3 J30.I5 J30.I7 J30.J2 J30.J4 J30.J6 J30.J8 J30.L1 J30.L3 J30.L5 J30.L7 J31.A2 J31.A4 J31.C1 J31.C3 J31.D2 J31.D4 J31.F1 J31.F3 J31.G2 J31.G4 J31.I1 J31.I3 J31.J2 J31.J4 J31.L1 J31.L3
1_PE_CLK_N: J31.B5 ; port 1_PE_CLK_N
1_PE_CLK_P: J31.A5 ; port 1_PE_CLK_P
1_PE_CLKE#: J31.C5 ; port 1_PE_CLKE#
2_PE_CLK_N: J31.E5 ; port 2_PE_CLK_N
2_PE_CLK_P: J31.D5 ; port 2_PE_CLK_P
2_PE_CLKE#: J31.F5 ; port 2_PE_CLKE#
3_PE_CLK_N: J31.H5 ; port 3_PE_CLK_N
3_PE_CLK_P: J31.G5 ; port 3_PE_CLK_P
3_PE_CLKE#: J31.I5 ; port 3_PE_CLKE#
4_PE_CLK_N: J31.K5 ; port 4_PE_CLK_N
4_PE_CLK_P: J31.J5 ; port 4_PE_CLK_P
4_PE_CLKE#: J31.L5 ; port 4_PE_CLKE#
5_PE_CLK_N: J31.C6 ; port 5_PE_CLK_N
5_PE_CLK_P: J31.B6 ; port 5_PE_CLK_P
5_PE_CLKE#: J31.A6 ; port 5_PE_CLKE#
6_PE_CLK_N: J31.F6 ; port 6_PE_CLK_N
6_PE_CLK_P: J31.E6 ; port 6_PE_CLK_P
6_PE_CLKE#: J31.D6 ; port 6_PE_CLKE#
7_PE_CLK_N: J31.I6 ; port 7_PE_CLK_N
7_PE_CLK_P: J31.H6 ; port 7_PE_CLK_P
7_PE_CLKE#: J31.G6 ; port 7_PE_CLKE#
8_PE_CLK_N: J31.L6 ; port 8_PE_CLK_N
8_PE_CLK_P: J31.K6 ; port 8_PE_CLK_P
8_PE_CLKE#: J31.J6 ; port 8_PE_CLKE#
SLOT0.LVDS_0_N: J30.B1
SLOT0.LVDS_0_P: J30.A1
SLOT0.LVDS_1_N: J30.E1
SLOT0.LVDS_1_P: J30.D1
SLOT0.LVDS_2_N: J30.H1
SLOT0.LVDS_2_P: J30.G1
SLOT0.LVDS_3_N: J30.K1
SLOT0.LVDS_3_P: J30.J1
SLOT0.LVDS_4_N: J30.C2
SLOT0.LVDS_4_P: J30.B2
SLOT0.LVDS_5_N: J30.F2
SLOT0.LVDS_5_P: J30.E2
SLOT0.LVDS_6_N: J30.I2
SLOT0.LVDS_6_P: J30.H2
SLOT0.LVDS_7_N: J30.L2
SLOT0.LVDS_7_P: J30.K2
SLOT3.LVDS_0_N: J30.B7
SLOT3.LVDS_0_P: J30.A7
SLOT3.LVDS_1_N: J30.E7
SLOT3.LVDS_1_P: J30.D7
SLOT3.LVDS_2_N: J30.H7
SLOT3.LVDS_2_P: J30.G7
SLOT3.LVDS_3_N: J30.K7
SLOT3.LVDS_3_P: J30.J7
SLOT3.LVDS_4_N: J30.C8
SLOT3.LVDS_4_P: J30.B8
SLOT3.LVDS_5_N: J30.F8
SLOT3.LVDS_5_P: J30.E8
SLOT3.LVDS_6_N: J30.I8
SLOT3.LVDS_6_P: J30.H8
SLOT3.LVDS_7_N: J30.L8
SLOT3.LVDS_7_P: J30.K8
SLOT4.LVDS_0_N: J30.B3
SLOT4.LVDS_0_P: J30.A3
SLOT4.LVDS_1_N: J30.E3
SLOT4.LVDS_1_P: J30.D3
SLOT4.LVDS_2_N: J30.H3
SLOT4.LVDS_2_P: J30.G3
SLOT4.LVDS_3_N: J30.K3
SLOT4.LVDS_3_P: J30.J3
SLOT4.LVDS_4_N: J30.C4
SLOT4.LVDS_4_P: J30.B4
SLOT4.LVDS_5_N: J30.F4
SLOT4.LVDS_5_P: J30.E4
SLOT4.LVDS_6_N: J30.I4
SLOT4.LVDS_6_P: J30.H4
SLOT4.LVDS_7_N: J30.L4
SLOT4.LVDS_7_P: J30.K4
SLOT5.LVDS_0_N: J30.B5
SLOT5.LVDS_0_P: J30.A5
SLOT5.LVDS_1_N: J30.E5
SLOT5.LVDS_1_P: J30.D5
SLOT5.LVDS_2_N: J30.H5
SLOT5.LVDS_2_P: J30.G5
SLOT5.LVDS_3_N: J30.K5
SLOT5.LVDS_3_P: J30.J5
SLOT5.LVDS_4_N: J30.C6
SLOT5.LVDS_4_P: J30.B6
SLOT5.LVDS_5_N: J30.F6
SLOT5.LVDS_5_P: J30.E6
SLOT5.LVDS_6_N: J30.I6
SLOT5.LVDS_6_P: J30.H6
SLOT5.LVDS_7_N: J30.L6
SLOT5.LVDS_7_P: J30.K6
SLOT6.LVDS_4_N: J5.B5
SLOT6.LVDS_4_P: J5.A5
SLOT6.LVDS_5_N: J5.E5
SLOT6.LVDS_5_P: J5.D5
SLOT6.LVDS_6_N: J5.H5
SLOT6.LVDS_6_P: J5.G5
SLOT6.LVDS_7_N: J5.K5
SLOT6.LVDS_7_P: J5.J5
SLOT7.LVDS_0_N: J31.B1
SLOT7.LVDS_0_P: J31.A1
SLOT7.LVDS_1_N: J31.E1
SLOT7.LVDS_1_P: J31.D1
SLOT7.LVDS_2_N: J31.H1
SLOT7.LVDS_2_P: J31.G1
SLOT7.LVDS_3_N: J31.K1
SLOT7.LVDS_3_P: J31.J1
SLOT7.LVDS_4_N: J31.C2
SLOT7.LVDS_4_P: J31.B2
SLOT7.LVDS_5_N: J31.F2
SLOT7.LVDS_5_P: J31.E2
SLOT7.LVDS_6_N: J31.I2
SLOT7.LVDS_6_P: J31.H2
SLOT7.LVDS_7_N: J31.L2
SLOT7.LVDS_7_P: J31.K2
SLOT8.LVDS_4_N: J5.C4
SLOT8.LVDS_4_P: J5.B4
SLOT8.LVDS_5_N: J5.F4
SLOT8.LVDS_5_P: J5.E4
SLOT8.LVDS_6_N: J5.I4
SLOT8.LVDS_6_P: J5.H4
SLOT8.LVDS_7_N: J5.L4
SLOT8.LVDS_7_P: J5.K4
SLOT9.LVDS_4_N: J5.B3
SLOT9.LVDS_4_P: J5.A3
SLOT9.LVDS_5_N: J5.E3
SLOT9.LVDS_5_P: J5.D3
SLOT9.LVDS_6_N: J5.H3
SLOT9.LVDS_6_P: J5.G3
SLOT9.LVDS_7_N: J5.K3
SLOT9.LVDS_7_P: J5.J3
SLOT10.LVDS_0_N: J31.B3
SLOT10.LVDS_0_P: J31.A3
SLOT10.LVDS_1_N: J31.E3
SLOT10.LVDS_1_P: J31.D3
SLOT10.LVDS_2_N: J31.H3
SLOT10.LVDS_2_P: J31.G3
SLOT10.LVDS_3_N: J31.K3
SLOT10.LVDS_3_P: J31.J3
SLOT10.LVDS_4_N: J31.C4
SLOT10.LVDS_4_P: J31.B4
SLOT10.LVDS_5_N: J31.F4
SLOT10.LVDS_5_P: J31.E4
SLOT10.LVDS_6_N: J31.I4
SLOT10.LVDS_6_P: J31.H4
SLOT10.LVDS_7_N: J31.L4
SLOT10.LVDS_7_P: J31.K4
SLOT11.LVDS_4_N: J5.C2
SLOT11.LVDS_4_P: J5.B2
SLOT11.LVDS_5_N: J5.F2
SLOT11.LVDS_5_P: J5.E2
SLOT11.LVDS_6_N: J5.I2
SLOT11.LVDS_6_P: J5.H2
SLOT11.LVDS_7_N: J5.L2
SLOT11.LVDS_7_P: J5.K2

Not connected (* = marked no-connect by the designer): J5 A1 A7 B1 B6 B7 B8 C6 C8 D1 D7 E1 E6 E7 E8 F6 F8 G1 G7 H1 H6 H7 H8 I6 I8 J1 J7 K1 K6 K7 K8 L6 L8

### Buses and harness runs
harness SLOT0 = port SLOT0
harness SLOT1 = port SLOT1
harness SLOT2 = port SLOT2
harness SLOT3 = port SLOT3
harness SLOT4 = port SLOT4
harness SLOT5 = port SLOT5
harness SLOT6 = port SLOT6
harness SLOT7 = port SLOT7
harness SLOT8 = port SLOT8
harness SLOT9 = port SLOT9
harness SLOT10 = port SLOT10
harness SLOT11 = port SLOT11

### Notes on the sheet
- (near J30) 3_PE_Tx00+
- (near J30) GND
- (near J30) 4_PE_Tx00+
- (near J30) P4 connector
- (near J30) 5_PE_Tx00+
- (near J30) 6_PE_Tx00+
- (near J30) Slot 6 not connected
- (near J30) 3_PE_Tx00-
- (near J30) 3_PE_Rx00+
- (near J30) 3_PE_Rx00-
- (near J30) 3_PE_Tx02+
- (near J30) 3_PE_Tx02-
- (near J30) 3_PE_Rx02+
- (near J30) 4_PE_Tx00-
- (near J30) 4_PE_Rx00+
- (near J30) 4_PE_Rx00-
- (near J30) 4_PE_Tx02+
- (near J30) 4_PE_Tx02-
- (near J30) 4_PE_Rx02+
- (near J30) 5_PE_Tx00-
- (near J30) 5_PE_Rx00+
- (near J30) 5_PE_Rx00-
- (near J30) 5_PE_Tx02+
- (near J30) 5_PE_Tx02-
- (near J30) 5_PE_Rx02+
- (near J30) 6_PE_Tx00-
- (near J30) 6_PE_Rx00+
- (near J30) 6_PE_Rx00-
- (near J30) 6_PE_Tx02+
- (near J30) 6_PE_Tx02-
- (near J30) 6_PE_Rx02+
- (near J30) 3_PE_Tx01+
- (near J30) 3_PE_Tx01-
- (near J30) 3_PE_Rx01+
- (near J30) 3_PE_Rx01-
- (near J30) 3_PE_Rx02-
- (near J30) 3_PE_Tx03+
- (near J30) 3_PE_Tx03-
- (near J30) 3_PE_Rx03+
- (near J30) 4_PE_Tx01+
- (near J30) 4_PE_Tx01-
- (near J30) 4_PE_Rx01+
- (near J30) 4_PE_Rx01-
- (near J30) 4_PE_Rx02-
- (near J30) 4_PE_Tx03+
- (near J30) 4_PE_Tx03-
- (near J30) 4_PE_Rx03+
- (near J30) 5_PE_Tx01+
- (near J30) 5_PE_Tx01-
- (near J30) 5_PE_Rx01+
- (near J30) 5_PE_Rx01-
- (near J30) 5_PE_Rx02-
- (near J30) 5_PE_Tx03+
- (near J30) 5_PE_Tx03-
- (near J30) 5_PE_Rx03+
- (near J30) 6_PE_Tx01+
- (near J30) 6_PE_Tx01-
- (near J30) 6_PE_Rx01+
- (near J30) 6_PE_Rx01-
- (near J30) 6_PE_Rx02-
- (near J30) 6_PE_Tx03+
- (near J30) 6_PE_Tx03-
- (near J30) 6_PE_Rx03+
- (near J30) 3_PE_Rx03-
- (near J30) 4_PE_Rx03-
- (near J30) 5_PE_Rx03-
- (near J30) 6_PE_Rx03-
- P5 connector
- Slot 6, 8 not connected
- (near J31) 7_PE_Tx00+
- (near J31) 7_PE_Tx00-
- (near J31) GND
- (near J31) 7_PE_Tx02+
- (near J31) 8_PE_Tx00+
- (near J31) 8_PE_Tx00-
- (near J31) 8_PE_Tx02+
- These are not Jtag lines. DIOT will use them to detect which slots have Periph Boards plugged.
- (near J31) 7_PE_Tx01+
- (near J31) 7_PE_Rx00+
- (near J31) 7_PE_Rx00-
- (near J31) 7_PE_Tx02-
- (near J31) 7_PE_Rx02+
- (near J31) 7_PE_Rx02-
- (near J31) 8_PE_Tx01+
- (near J31) 8_PE_Rx00+
- (near J31) 8_PE_Rx00-
- (near J31) 8_PE_Tx02-
- (near J31) 8_PE_Rx02+
- (near J31) 8_PE_Rx02-
- (near J31) 7_PE_Tx01-
- (near J31) 7_PE_Rx01+
- (near J31) 7_PE_Rx01-
- (near J31) 7_PE_Tx03+
- (near J31) 7_PE_Tx03-
- (near J31) 7_PE_Rx03+
- (near J31) 7_PE_Rx03-
- (near J31) 8_PE_Tx01-
- (near J31) 8_PE_Rx01+
- (near J31) 8_PE_Rx01-
- (near J31) 8_PE_Tx03+
- (near J31) 8_PE_Tx03-
- (near J31) 8_PE_Rx03+
- (near J31) 8_PE_Rx03-
- Slot 8 not connected
- (near J5) P6 connector
- (near J5) 1_ETH_A+
- (near J5) 1_ETH_A-
- (near J5) GND
- (near J5) 1_ETH_B+
- (near J5) 2_ETH_A+
- (near J5) 2_ETH_A-
- (near J5) 3_ETH_A+
- (near J5) 3_ETH_A-
- (near J5) 3_ETH_B+
- (near J5) 4_ETH_A+
- (near J5) 4_ETH_A-
- (near J5) 5_ETH_A+
- (near J5) 5_ETH_A-
- (near J5) 5_ETH_B+
- (near J5) 6_ETH_A+
- (near J5) 6_ETH_A-
- (near J5) 7_ETH_A+
- (near J5) 7_ETH_A-
- (near J5) 7_ETH_B+
- (near J5) DECT_RIO
- (near J5) 8_ETH_A+
- (near J5) 8_ETH_A-
- (near J5) DECT_BPR
- (near J5) 1_ETH_B-
- (near J5) 1_ETH_C+
- (near J5) 1_ETH_C-
- (near J5) 2_ETH_B+
- (near J5) 2_ETH_B-
- (near J5) 2_ETH_C+
- (near J5) 2_ETH_C-
- (near J5) 3_ETH_B-
- (near J5) 3_ETH_C+
- (near J5) 3_ETH_C-
- (near J5) 4_ETH_B+
- (near J5) 4_ETH_B-
- (near J5) 4_ETH_C+
- (near J5) 4_ETH_C-
- (near J5) 5_ETH_B-
- (near J5) 5_ETH_C+
- (near J5) 5_ETH_C-
- (near J5) 6_ETH_B+
- (near J5) 6_ETH_B-
- (near J5) 6_ETH_C+
- (near J5) 6_ETH_C-
- (near J5) 7_ETH_B-
- (near J5) 7_ETH_C+
- (near J5) 7_ETH_C-
- (near J5) 8_ETH_B+
- (near J5) 8_ETH_B-
- (near J5) 8_ETH_C+
- (near J5) 8_ETH_C-
- (near J5) 1_ETH_D+
- (near J5) 1_ETH_D-
- (near J5) 2_ETH_D+
- (near J5) 2_ETH_D-
- (near J5) 3_ETH_D+
- (near J5) 3_ETH_D-
- (near J5) 4_ETH_D+
- (near J5) 4_ETH_D-
- (near J5) 5_ETH_D+
- (near J5) 5_ETH_D-
- (near J5) 6_ETH_D+
- (near J5) 6_ETH_D-
- (near J5) 7_ETH_D+
- (near J5) 7_ETH_D-
- (near J5) 8_ETH_D+
- (near J5) 8_ETH_D-
- Copyright CERN 2018.
  This documentation describes Open Hardware and is licensed under the CERN OHL v. 1.2.
  You may redistribute and modify this documentation under the terms of the CERN OHL v.1.2. (http://ohwr.org/cernohl). This documentation is distributed WITHOUT ANY EXPRESS OR IMPLIED WARRANTY, INCLUDING OF MERCHANTABILITY, SATISFACTORY QUALITY AND FITNESS FOR A PARTICULAR PURPOSE. Please see the CERN OHL v.1.2 for applicable conditions
- Project/Equipment
- Document
- Designer
- Drawn by
- Check.by
- File
- Last Mod.
- Print Date
- Sheet
- Size
- A3
- of
- Rev

### Library data of the parts
J5 = AMPHENOL_10052838-101LF: 96 Contacts Header, 8 Columns, 4 Pairs per Column; Part Description: 96 Contacts, 2mm Pitch, 8 Columns, 4 Pairs per Column, 4 Walls, Right Angle Header; Part Number: AMPHENOL_10052838-101LF; Component Kind: Standard; Component Type: Standard; Pin Count: 96; Family: AirMax VS; Mounted: Yes; Socket: No; SMD: No; PressFit: Yes; Sense: No; Status: None; Manufacturer: AMPHENOL; Manufacturer Part Number: 10052838-101LF; ComponentHeight: 15.35mm; HelpURL: \\cern.ch\dfs\Applications\Altium\Datasheets\AMPHENOL_10052838-101LF.pdf; ComponentLink1URL: \\cern.ch\dfs\Applications\Altium\Datasheets\AMPHENOL_10052838-101LF_Application.pdf; ComponentLink1Description: Application; Author: CERN DEM MR; CreateDate: 19/02/2018; LatestRevisionDate: 19/02/2018; Classname: Overlapping
J30 = AMPHENOL_10052837-101LF: as J29 on sheet Cpcis_connectors_P1_P2_P3; Part Number: AMPHENOL_10052837-101LF; Component Kind: Standard; Component Type: Standard; Pin Count: 96; Family: AirMax VS; Mounted: Yes; Socket: No; SMD: No; PressFit: Yes; Sense: No; Status: None; Manufacturer: AMPHENOL; Manufacturer Part Number: 10052837-101LF; ComponentHeight: 15.35mm; HelpURL: \\cern.ch\dfs\Applications\Altium\Datasheets\AMPHENOL_10052837-101LF.pdf; ComponentLink1URL: \\cern.ch\dfs\Applications\Altium\Datasheets\AMPHENOL_10052837-101LF_Application.pdf; ComponentLink1Description: Application; Author: CERN DEM MR; CreateDate: 19/02/2018; LatestRevisionDate: 19/02/2018
J31 = AMPHENOL_10052824-101LF: 72 Contacts Header, 6 Columns, 4 Pairs per Column; Part Description: 72 Contacts, 2mm Pitch, 6 Columns, 4 Pairs per Column, 2 Walls, Right Angle Header; Part Number: AMPHENOL_10052824-101LF; Component Kind: Standard; Component Type: Standard; Pin Count: 72; Family: AirMax VS; Mounted: Yes; Socket: No; SMD: No; PressFit: Yes; Sense: No; Status: None; Manufacturer: AMPHENOL; Manufacturer Part Number: 10052824-101LF; ComponentHeight: 15.35mm; HelpURL: \\cern.ch\dfs\Applications\Altium\Datasheets\AMPHENOL_10052824-101LF.pdf; ComponentLink1URL: \\cern.ch\dfs\Applications\Altium\Datasheets\AMPHENOL_10052824-101LF_Application.pdf; ComponentLink1Description: Application; Author: CERN DEM JMW; CreateDate: 29/11/2017; LatestRevisionDate: 29/11/2017